# Altium project IMX6ULL_CORE.PrjPcb (part 2 of 2)
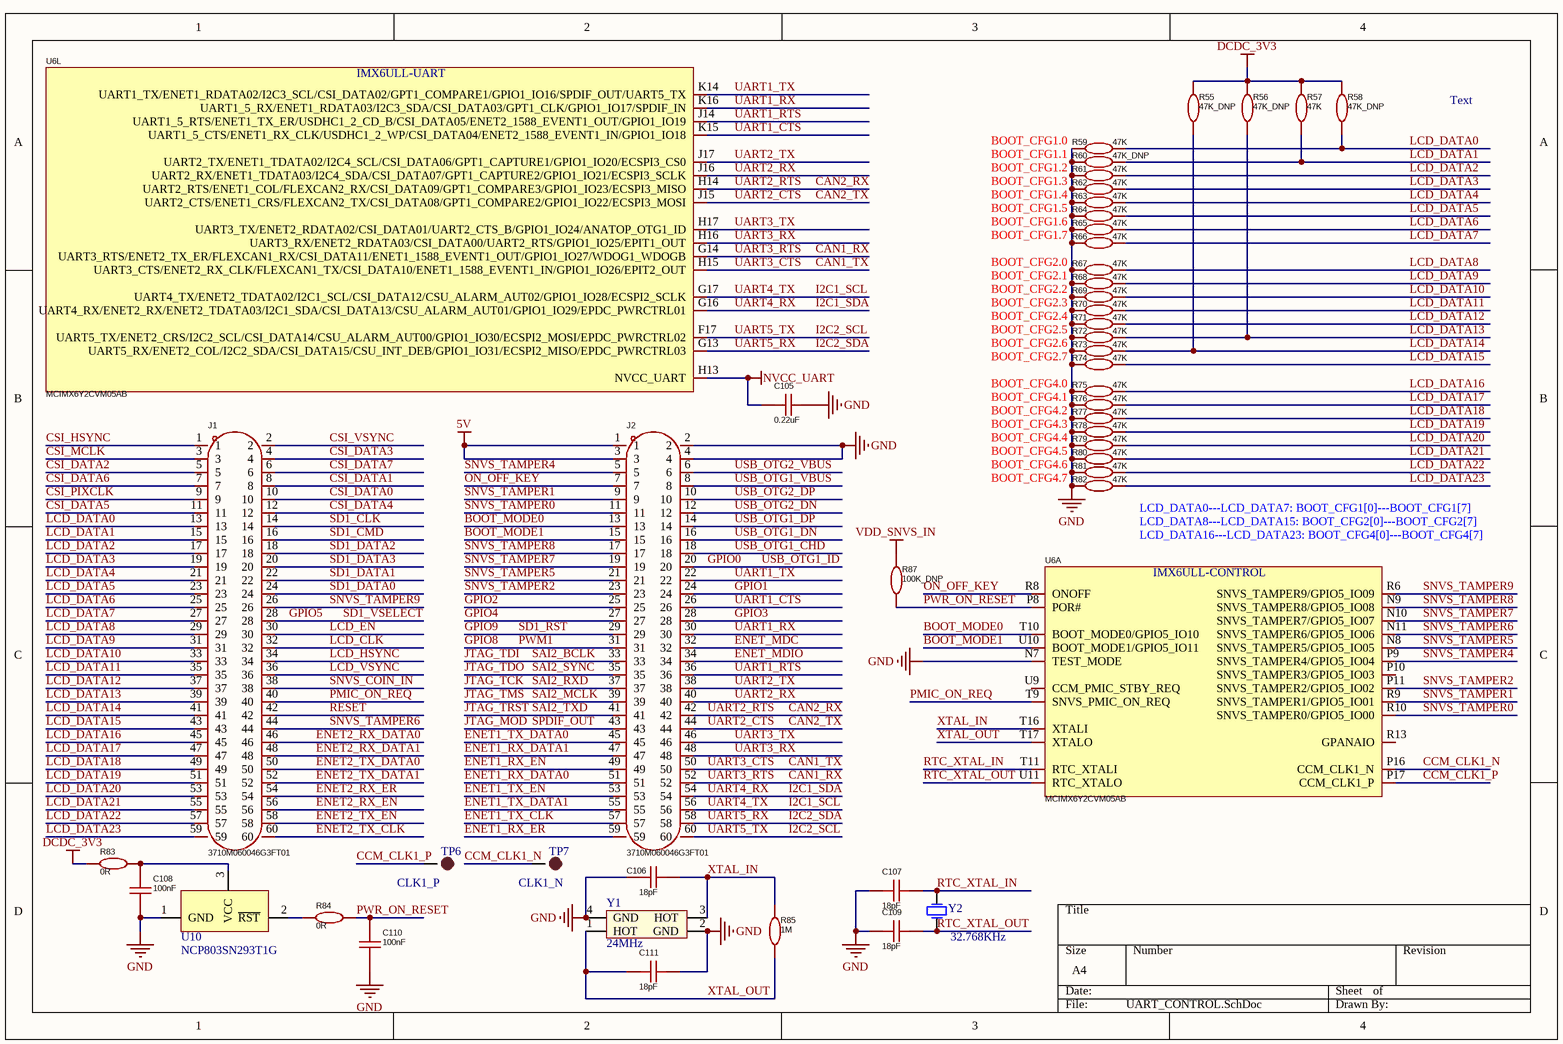
[diagram p5: UART_CONTROL.SchDoc]

## Nets that join several sheets
5V: INPUT_POWER (15 pins), UART_CONTROL (J2.1 J2.3)
DCDC_3V3: INPUT_POWER (5 pins), FLASH_CSI (31 pins), LCD_NET_GPIO_JTAG_SD_USB (9 pins), UART_CONTROL (7 pins)
DRAM_1V35: INPUT_POWER (R19.2), MX6ULL_DDR (46 pins)
GND: INPUT_POWER (112 pins), MX6ULL_DDR (53 pins), FLASH_CSI (29 pins), LCD_NET_GPIO_JTAG_SD_USB (12 pins), UART_CONTROL (37 pins)
NVCC_SD: INPUT_POWER (6 pins), LCD_NET_GPIO_JTAG_SD_USB (C101.2 R48.2 R49.2 U6.C4)
SNVS_CSI: INPUT_POWER (C9.2 LDO1.2 TP2.1), FLASH_CSI (C94.2 U6.F4)
SNVS_IN: INPUT_POWER (5 pins), UART_CONTROL (R87.2)
CSI_DATA0: FLASH_CSI (U6.E4), UART_CONTROL (J1.10)
CSI_DATA1: FLASH_CSI (U6.E3), UART_CONTROL (J1.8)
CSI_DATA2: FLASH_CSI (U6.E2), UART_CONTROL (J1.5)
CSI_DATA3: FLASH_CSI (U6.E1), UART_CONTROL (J1.4)
CSI_DATA4: FLASH_CSI (U6.D4), UART_CONTROL (J1.12)
CSI_DATA5: FLASH_CSI (U6.D3), UART_CONTROL (J1.11)
CSI_DATA6: FLASH_CSI (U6.D2), UART_CONTROL (J1.7)
CSI_DATA7: FLASH_CSI (U6.D1), UART_CONTROL (J1.6)
CSI_HSYNC: FLASH_CSI (U6.F3), UART_CONTROL (J1.1)
CSI_MCLK: FLASH_CSI (U6.F5), UART_CONTROL (J1.3)
CSI_PIXCLK: FLASH_CSI (U6.E5), UART_CONTROL (J1.9)
CSI_VSYNC: FLASH_CSI (U6.F2), UART_CONTROL (J1.2)
ECSPI4_MISO: LCD_NET_GPIO_JTAG_SD_USB (R46.1), UART_CONTROL (J1.60)
ECSPI4_MOSI: LCD_NET_GPIO_JTAG_SD_USB (U6.B15), UART_CONTROL (J1.58)
ECSPI4_SCLK: LCD_NET_GPIO_JTAG_SD_USB (U6.A16), UART_CONTROL (J1.52)
ECSPI4_SS: LCD_NET_GPIO_JTAG_SD_USB (U6.D16), UART_CONTROL (J1.54)
ENET1_RX_DATA0: LCD_NET_GPIO_JTAG_SD_USB (U6.F16), UART_CONTROL (J2.51)
ENET1_RX_DATA1: LCD_NET_GPIO_JTAG_SD_USB (U6.E17), UART_CONTROL (J2.47)
ENET1_RX_EN: LCD_NET_GPIO_JTAG_SD_USB (U6.E16), UART_CONTROL (J2.49)
ENET1_RX_ER: LCD_NET_GPIO_JTAG_SD_USB (U6.D15), UART_CONTROL (J2.59)
ENET1_TX_CLK: LCD_NET_GPIO_JTAG_SD_USB (R47.1), UART_CONTROL (J2.57)
ENET1_TX_DATA0: LCD_NET_GPIO_JTAG_SD_USB (U6.E15), UART_CONTROL (J2.45)
ENET1_TX_DATA1: LCD_NET_GPIO_JTAG_SD_USB (U6.E14), UART_CONTROL (J2.55)
ENET1_TX_EN: LCD_NET_GPIO_JTAG_SD_USB (U6.F15), UART_CONTROL (J2.53)
ENET2_RX_DATA0: LCD_NET_GPIO_JTAG_SD_USB (U6.C17), UART_CONTROL (J1.46)
ENET2_RX_DATA1: LCD_NET_GPIO_JTAG_SD_USB (U6.C16), UART_CONTROL (J1.48)
ENET2_RX_EN: LCD_NET_GPIO_JTAG_SD_USB (U6.B17), UART_CONTROL (J1.56)
ENET2_TX_DATA0: LCD_NET_GPIO_JTAG_SD_USB (U6.A15), UART_CONTROL (J1.50)
ENET_MDC: LCD_NET_GPIO_JTAG_SD_USB (U6.L16), UART_CONTROL (J2.32)
ENET_MDIO: LCD_NET_GPIO_JTAG_SD_USB (U6.K17), UART_CONTROL (J2.34)
GPIO0: LCD_NET_GPIO_JTAG_SD_USB (U6.K13), UART_CONTROL (J2.20)
GPIO1: LCD_NET_GPIO_JTAG_SD_USB (U6.L15), UART_CONTROL (J2.24)
GPIO2: LCD_NET_GPIO_JTAG_SD_USB (U6.L14), UART_CONTROL (J2.25)
GPIO3: LCD_NET_GPIO_JTAG_SD_USB (U6.L17), UART_CONTROL (J2.28)
GPIO4: LCD_NET_GPIO_JTAG_SD_USB (U6.M16), UART_CONTROL (J2.27)
GPIO5: INPUT_POWER (Q2.2 R15.2), LCD_NET_GPIO_JTAG_SD_USB (U6.M17), UART_CONTROL (J1.28)
GPIO8: LCD_NET_GPIO_JTAG_SD_USB (U6.N17), UART_CONTROL (J2.31)
GPIO9: LCD_NET_GPIO_JTAG_SD_USB (U6.M15), UART_CONTROL (J2.29)
HIGH_CAP: INPUT_POWER (C34.2 C35.2 U6.R14 U6.R15), MX6ULL_DDR (C54.2 U6.N6)
JTAG_MOD: LCD_NET_GPIO_JTAG_SD_USB (R54.2 U6.P15), UART_CONTROL (J2.43)
JTAG_TCK: LCD_NET_GPIO_JTAG_SD_USB (R52.2 U6.M14), UART_CONTROL (J2.37)
JTAG_TDI: LCD_NET_GPIO_JTAG_SD_USB (U6.N16), UART_CONTROL (J2.33)
JTAG_TDO: LCD_NET_GPIO_JTAG_SD_USB (U6.N15), UART_CONTROL (J2.35)
JTAG_TMS: LCD_NET_GPIO_JTAG_SD_USB (U6.P14), UART_CONTROL (J2.39)
JTAG_TRST: LCD_NET_GPIO_JTAG_SD_USB (U6.N14), UART_CONTROL (J2.41)
LCD_CLK: LCD_NET_GPIO_JTAG_SD_USB (R51.2), UART_CONTROL (J1.32)
LCD_DATA0: LCD_NET_GPIO_JTAG_SD_USB (U6.B9), UART_CONTROL (J1.13 R58.1 R59.2)
LCD_DATA1: LCD_NET_GPIO_JTAG_SD_USB (U6.A9), UART_CONTROL (J1.15 R57.1 R60.2)
LCD_DATA2: LCD_NET_GPIO_JTAG_SD_USB (U6.E10), UART_CONTROL (J1.17 R61.2)
LCD_DATA3: LCD_NET_GPIO_JTAG_SD_USB (U6.D10), UART_CONTROL (J1.19 R62.2)
LCD_DATA4: LCD_NET_GPIO_JTAG_SD_USB (U6.C10), UART_CONTROL (J1.21 R63.2)
LCD_DATA5: LCD_NET_GPIO_JTAG_SD_USB (U6.B10), UART_CONTROL (J1.23 R64.2)
LCD_DATA6: LCD_NET_GPIO_JTAG_SD_USB (U6.A10), UART_CONTROL (J1.25 R65.2)
LCD_DATA7: LCD_NET_GPIO_JTAG_SD_USB (U6.D11), UART_CONTROL (J1.27 R66.2)
LCD_DATA8: LCD_NET_GPIO_JTAG_SD_USB (U6.B11), UART_CONTROL (J1.29 R67.2)
LCD_DATA9: LCD_NET_GPIO_JTAG_SD_USB (U6.A11), UART_CONTROL (J1.31 R68.2)
LCD_DATA10: LCD_NET_GPIO_JTAG_SD_USB (U6.E12), UART_CONTROL (J1.33 R69.2)
LCD_DATA11: LCD_NET_GPIO_JTAG_SD_USB (U6.D12), UART_CONTROL (J1.35 R70.2)
LCD_DATA12: LCD_NET_GPIO_JTAG_SD_USB (U6.C12), UART_CONTROL (J1.37 R71.2)
LCD_DATA13: LCD_NET_GPIO_JTAG_SD_USB (U6.B12), UART_CONTROL (J1.39 R56.1 R72.2)
LCD_DATA14: LCD_NET_GPIO_JTAG_SD_USB (U6.A12), UART_CONTROL (J1.41 R55.1 R73.2)
LCD_DATA15: LCD_NET_GPIO_JTAG_SD_USB (U6.D13), UART_CONTROL (J1.43 R74.2)
LCD_DATA16: LCD_NET_GPIO_JTAG_SD_USB (U6.C13), UART_CONTROL (J1.45 R75.2)
LCD_DATA17: LCD_NET_GPIO_JTAG_SD_USB (U6.B13), UART_CONTROL (J1.47 R76.2)
LCD_DATA18: LCD_NET_GPIO_JTAG_SD_USB (U6.A13), UART_CONTROL (J1.49 R77.2)
LCD_DATA19: LCD_NET_GPIO_JTAG_SD_USB (U6.D14), UART_CONTROL (J1.51 R78.2)
LCD_DATA20: LCD_NET_GPIO_JTAG_SD_USB (U6.C14), UART_CONTROL (J1.53 R79.2)
LCD_DATA21: LCD_NET_GPIO_JTAG_SD_USB (U6.B14), UART_CONTROL (J1.55 R80.2)
LCD_DATA22: LCD_NET_GPIO_JTAG_SD_USB (U6.A14), UART_CONTROL (J1.57 R81.2)
LCD_DATA23: LCD_NET_GPIO_JTAG_SD_USB (U6.B16), UART_CONTROL (J1.59 R82.2)
LCD_EN: LCD_NET_GPIO_JTAG_SD_USB (U6.B8), UART_CONTROL (J1.30)
LCD_HSYNC: LCD_NET_GPIO_JTAG_SD_USB (U6.D9), UART_CONTROL (J1.34)
LCD_VSYNC: LCD_NET_GPIO_JTAG_SD_USB (U6.C9), UART_CONTROL (J1.36)
nWDOG: INPUT_POWER (C6.1), LCD_NET_GPIO_JTAG_SD_USB (R53.1)
PMIC_ON_REQ: INPUT_POWER (Q5.2 R8.1), UART_CONTROL (J1.40 U6.T9)
RESET: INPUT_POWER (R1.2), UART_CONTROL (J1.42)
SD1_CLK: LCD_NET_GPIO_JTAG_SD_USB (C100.2 R50.2), UART_CONTROL (J1.14)
SD1_CMD: LCD_NET_GPIO_JTAG_SD_USB (R49.1 U6.C2), UART_CONTROL (J1.16)
SD1_DATA0: LCD_NET_GPIO_JTAG_SD_USB (R48.1 U6.B3), UART_CONTROL (J1.24)
SD1_DATA1: LCD_NET_GPIO_JTAG_SD_USB (U6.B2), UART_CONTROL (J1.22)
SD1_DATA2: LCD_NET_GPIO_JTAG_SD_USB (U6.B1), UART_CONTROL (J1.18)
SD1_DATA3: LCD_NET_GPIO_JTAG_SD_USB (U6.A2), UART_CONTROL (J1.20)
SNVS_COIN_IN: INPUT_POWER (D4.1 R27.2), UART_CONTROL (J1.38)
USB_OTG1_CHD: LCD_NET_GPIO_JTAG_SD_USB (U6.U16), UART_CONTROL (J2.18)
USB_OTG1_DN: LCD_NET_GPIO_JTAG_SD_USB (U6.T15), UART_CONTROL (J2.16)
USB_OTG1_DP: LCD_NET_GPIO_JTAG_SD_USB (U6.U15), UART_CONTROL (J2.14)
USB_OTG1_VBUS: LCD_NET_GPIO_JTAG_SD_USB (C97.2 U6.T12), UART_CONTROL (J2.8)
USB_OTG2_DN: LCD_NET_GPIO_JTAG_SD_USB (U6.T13), UART_CONTROL (J2.12)
USB_OTG2_DP: LCD_NET_GPIO_JTAG_SD_USB (U6.U13), UART_CONTROL (J2.10)
USB_OTG2_VBUS: LCD_NET_GPIO_JTAG_SD_USB (C98.2 U6.U12), UART_CONTROL (J2.6)